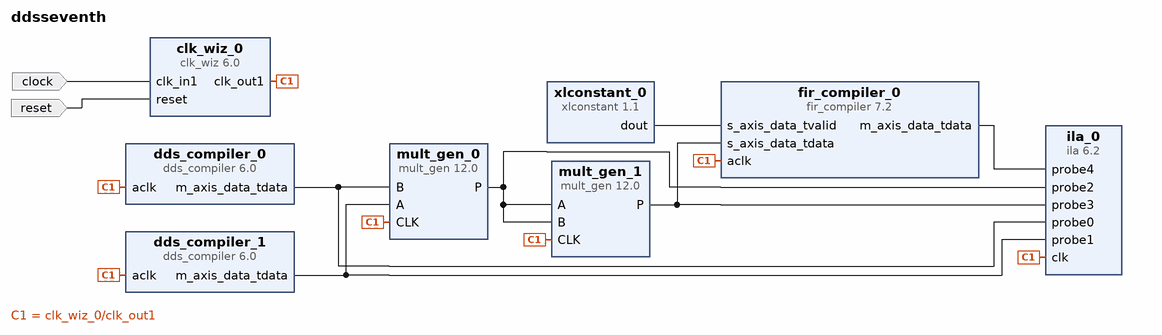
[diagram p0: block diagram of the top level]
# Vivado block design ddsseventh, xc7a35tcpg236-1, Vivado 2022.2
create_bd_design ddsseventh

create_bd_port -dir I clock
create_bd_port -dir I reset

create_bd_cell -type ip -vlnv xilinx.com:ip:dds_compiler:6.0 dds_compiler_0
set_property -dict [list \
  CONFIG.Amplitude_Mode Unit_Circle \
  CONFIG.DATA_Has_TLAST Not_Required \
  CONFIG.DDS_Clock_Rate 200 \
  CONFIG.Frequency_Resolution 0.02 \
  CONFIG.Has_Phase_Out false \
  CONFIG.Latency 3 \
  CONFIG.Latency_Configuration Auto \
  CONFIG.M_DATA_Has_TUSER Not_Required \
  CONFIG.Memory_Type Block_ROM \
  CONFIG.Negative_Sine false \
  CONFIG.Noise_Shaping Auto \
  CONFIG.Output_Frequency1 1 \
  CONFIG.Output_Selection Sine \
  CONFIG.Output_Width 7 \
  CONFIG.PINC1 101000111101011100001010001 \
  CONFIG.Parameter_Entry System_Parameters \
  CONFIG.Phase_Increment Fixed \
  CONFIG.Phase_Width 34 \
  CONFIG.Phase_offset None \
  CONFIG.S_PHASE_Has_TUSER Not_Required \
  CONFIG.Spurious_Free_Dynamic_Range 40 \
] [get_bd_cells dds_compiler_0]
create_bd_cell -type ip -vlnv xilinx.com:ip:clk_wiz:6.0 clk_wiz_0
set_property -dict [list \
  CONFIG.CLKOUT1_JITTER 114.829 \
  CONFIG.CLKOUT1_PHASE_ERROR 98.575 \
  CONFIG.CLKOUT1_REQUESTED_OUT_FREQ 200 \
  CONFIG.MMCM_CLKFBOUT_MULT_F 10.000 \
  CONFIG.MMCM_CLKOUT0_DIVIDE_F 5.000 \
  CONFIG.MMCM_DIVCLK_DIVIDE 1 \
  CONFIG.USE_LOCKED false \
] [get_bd_cells clk_wiz_0]
create_bd_cell -type ip -vlnv xilinx.com:ip:ila:6.2 ila_0
set_property -dict [list \
  CONFIG.C_DATA_DEPTH 4096 \
  CONFIG.C_MONITOR_TYPE Native \
  CONFIG.C_NUM_OF_PROBES 5 \
  CONFIG.C_PROBE0_WIDTH 8 \
  CONFIG.C_PROBE1_WIDTH 8 \
  CONFIG.C_PROBE2_WIDTH 16 \
  CONFIG.C_PROBE3_WIDTH 24 \
  CONFIG.C_PROBE4_WIDTH 56 \
] [get_bd_cells ila_0]
create_bd_cell -type ip -vlnv xilinx.com:ip:dds_compiler:6.0 dds_compiler_1
set_property -dict [list \
  CONFIG.Amplitude_Mode Unit_Circle \
  CONFIG.DDS_Clock_Rate 200 \
  CONFIG.Frequency_Resolution 0.02 \
  CONFIG.Has_Phase_Out false \
  CONFIG.Latency 3 \
  CONFIG.M_DATA_Has_TUSER Not_Required \
  CONFIG.Memory_Type Block_ROM \
  CONFIG.Noise_Shaping Auto \
  CONFIG.Output_Frequency1 20 \
  CONFIG.Output_Selection Sine \
  CONFIG.Output_Width 7 \
  CONFIG.PINC1 1100110011001100110011001100110 \
  CONFIG.Phase_Width 34 \
  CONFIG.Spurious_Free_Dynamic_Range 40 \
] [get_bd_cells dds_compiler_1]
create_bd_cell -type ip -vlnv xilinx.com:ip:mult_gen:12.0 mult_gen_0
set_property -dict {CONFIG.Multiplier_Construction Use_Mults CONFIG.PortAWidth 8 CONFIG.PortBWidth 8} [get_bd_cells mult_gen_0]
create_bd_cell -type ip -vlnv xilinx.com:ip:fir_compiler:7.2 fir_compiler_0
set_property -dict [list \
  CONFIG.Clock_Frequency 200 \
  CONFIG.CoefficientSource COE_File \
  CONFIG.Coefficient_File ../../../../../../../../../willwork.txt \
  CONFIG.Coefficient_Fractional_Bits 17 \
  CONFIG.Coefficient_Sets 1 \
  CONFIG.Coefficient_Sign Signed \
  CONFIG.Coefficient_Structure Inferred \
  CONFIG.Coefficient_Width 16 \
  CONFIG.ColumnConfig 32 \
  CONFIG.Data_Fractional_Bits 0 \
  CONFIG.Data_Sign Signed \
  CONFIG.Data_Width 32 \
  CONFIG.Filter_Architecture Systolic_Multiply_Accumulate \
  CONFIG.Output_Rounding_Mode Full_Precision \
  CONFIG.Output_Width 50 \
  CONFIG.Quantization Quantize_Only \
  CONFIG.Sample_Frequency 100 \
] [get_bd_cells fir_compiler_0]
create_bd_cell -type ip -vlnv xilinx.com:ip:xlconstant:1.1 xlconstant_0
create_bd_cell -type ip -vlnv xilinx.com:ip:mult_gen:12.0 mult_gen_1
set_property -dict [list \
  CONFIG.MultType Parallel_Multiplier \
  CONFIG.Multiplier_Construction Use_Mults \
  CONFIG.PortAWidth 16 \
  CONFIG.PortBWidth 16 \
] [get_bd_cells mult_gen_1]

# ---- connections ----

connect_bd_net [get_bd_pins clk_wiz_0/clk_out1] \
  [get_bd_pins dds_compiler_0/aclk] [get_bd_pins dds_compiler_1/aclk] [get_bd_pins mult_gen_0/CLK] [get_bd_pins ila_0/clk] \
  [get_bd_pins fir_compiler_0/aclk] [get_bd_pins mult_gen_1/CLK]
connect_bd_net [get_bd_ports clock] [get_bd_pins clk_wiz_0/clk_in1]
connect_bd_net [get_bd_pins dds_compiler_0/m_axis_data_tdata] [get_bd_pins ila_0/probe0] [get_bd_pins mult_gen_0/B]
connect_bd_net [get_bd_pins dds_compiler_1/m_axis_data_tdata] [get_bd_pins mult_gen_0/A] [get_bd_pins ila_0/probe1]
connect_bd_net [get_bd_pins fir_compiler_0/m_axis_data_tdata] [get_bd_pins ila_0/probe4]
connect_bd_net [get_bd_pins mult_gen_0/P] [get_bd_pins ila_0/probe2] [get_bd_pins mult_gen_1/A] [get_bd_pins mult_gen_1/B]
connect_bd_net [get_bd_pins mult_gen_1/P] [get_bd_pins ila_0/probe3] [get_bd_pins fir_compiler_0/s_axis_data_tdata]
connect_bd_net [get_bd_ports reset] [get_bd_pins clk_wiz_0/reset]
connect_bd_net [get_bd_pins xlconstant_0/dout] [get_bd_pins fir_compiler_0/s_axis_data_tvalid]

validate_bd_design
save_bd_design
